# EAGLE schematic msp430_minimal_schematic (EAGLE 7.0.0)
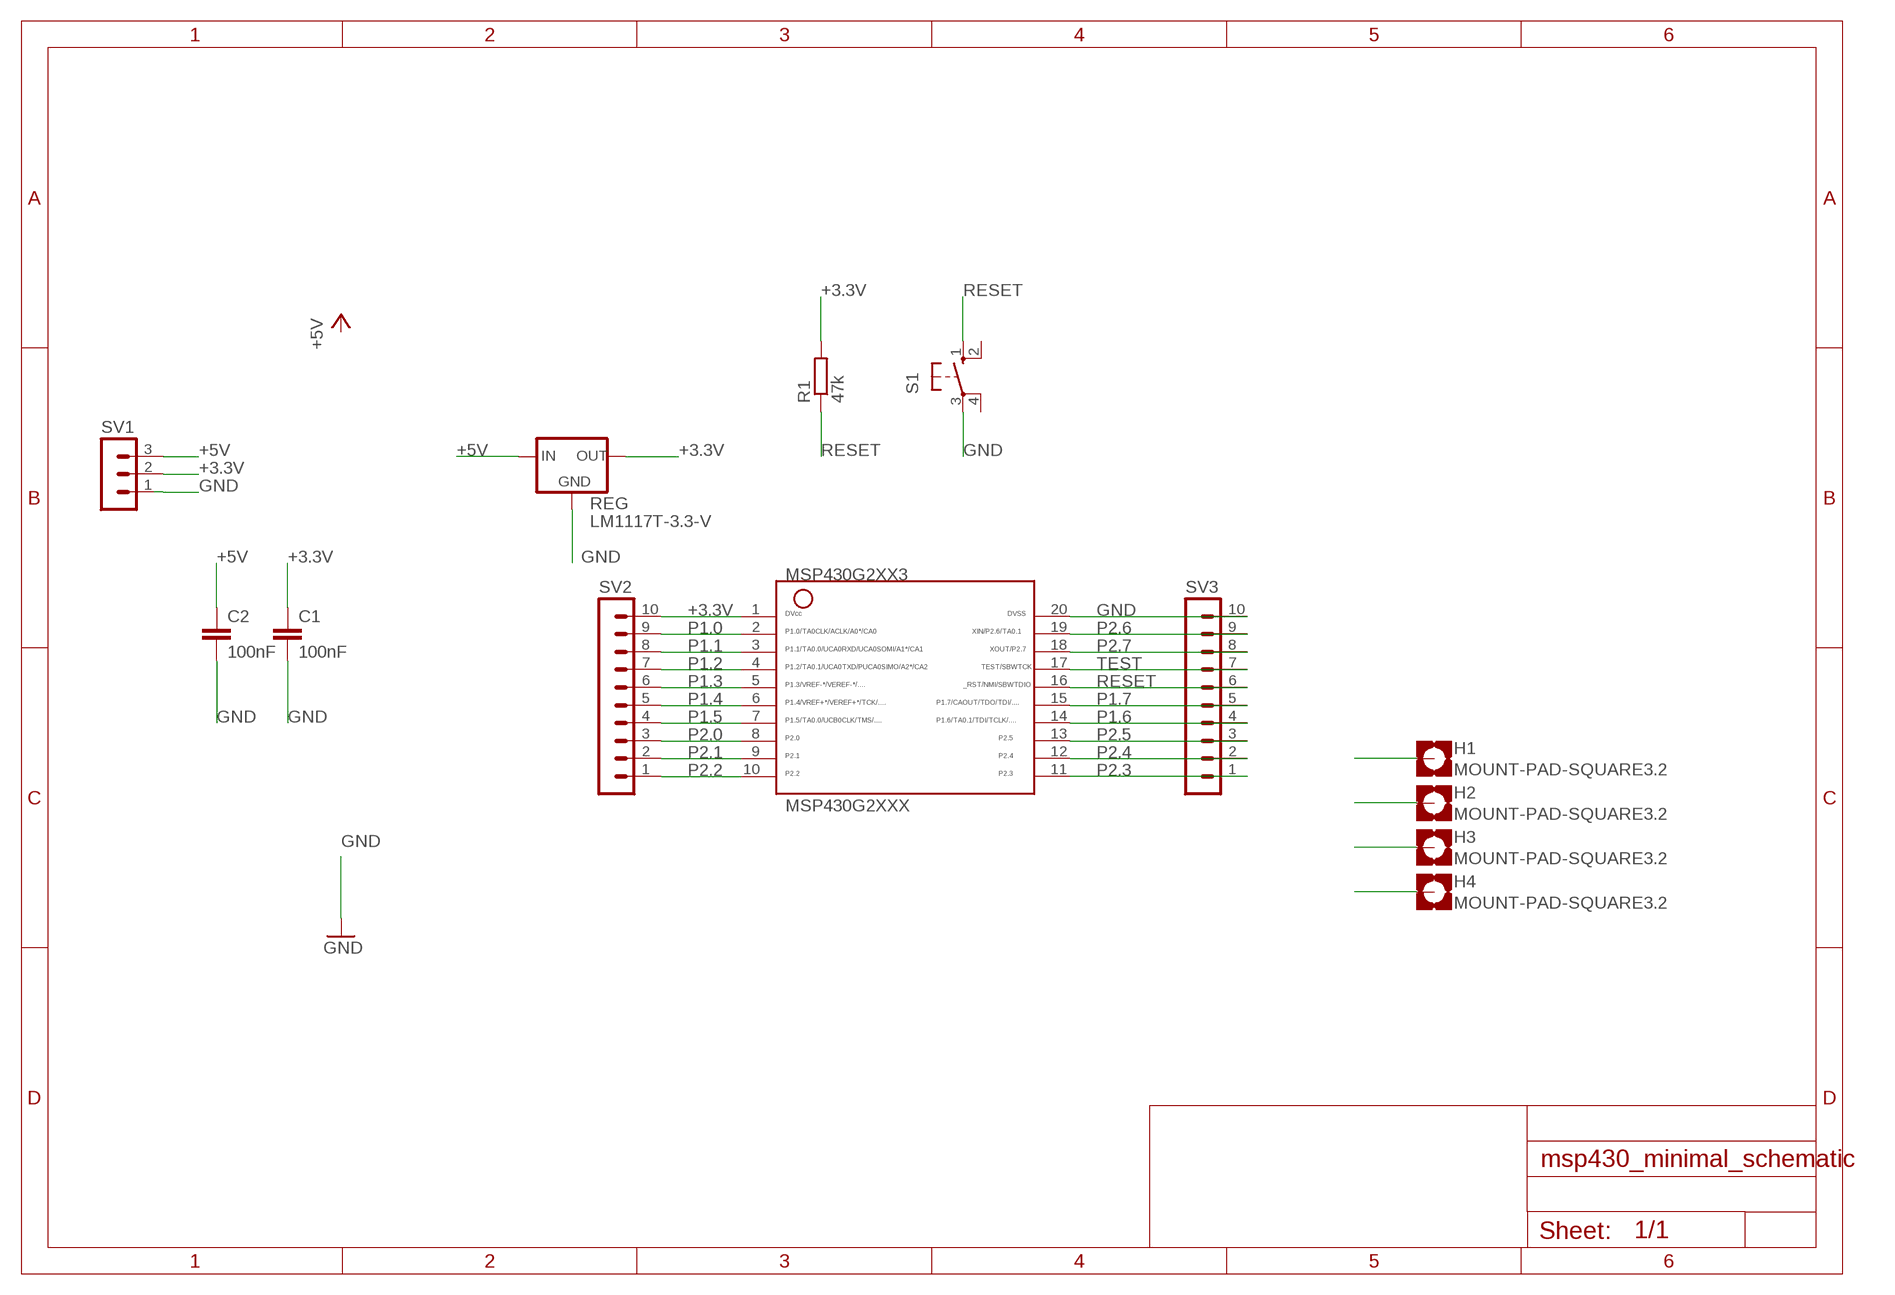
[diagram p0: schematic, sheet 1]

## Parts
C1  100nF  C-EU050-030X075  [C050-030X075]
C2  100nF  C-EU050-030X075  [C050-030X075]
H1  MOUNT-PAD-SQUARE3.2  [3,2-PAD-SQUARE]
H2  MOUNT-PAD-SQUARE3.2  [3,2-PAD-SQUARE]
H3  MOUNT-PAD-SQUARE3.2  [3,2-PAD-SQUARE]
H4  MOUNT-PAD-SQUARE3.2  [3,2-PAD-SQUARE]
MSP430G2XXX  G2XX3---N20  [N20]
R1  47k  R-EU_0204/7  [0204/7]
REG  LM1117T-3.3-V  [TO220V]
S1  10-XX  [B3F-10XX]
SV1  MA03-1  [MA03-1]
SV2  MA10-1  [MA10-1]
SV3  MA10-1  [MA10-1]

## Nets
+3.3V: C1.1 MSP430G2XXX.1 R1.2 REG.2(OUT) SV1.2 SV2.10
+5V: C2.1 REG.3(IN) SV1.3
GND: C1.2 C2.2 H1.B3,2(MOUNT) H2.B3,2(MOUNT) H3.B3,2(MOUNT) H4.B3,2(MOUNT) MSP430G2XXX.20 REG.1(GND) S1.3(P) SV1.1 SV3.10
P1.0: MSP430G2XXX.2 SV2.9
P1.1: MSP430G2XXX.3 SV2.8
P1.2: MSP430G2XXX.4 SV2.7
P1.3: MSP430G2XXX.5 SV2.6
P1.4: MSP430G2XXX.6 SV2.5
P1.5: MSP430G2XXX.7 SV2.4
P1.6: MSP430G2XXX.14 SV3.4
P1.7: MSP430G2XXX.15 SV3.5
P2.0: MSP430G2XXX.8 SV2.3
P2.1: MSP430G2XXX.9 SV2.2
P2.2: MSP430G2XXX.10 SV2.1
P2.3: MSP430G2XXX.11 SV3.1
P2.4: MSP430G2XXX.12 SV3.2
P2.5: MSP430G2XXX.13 SV3.3
P2.6: MSP430G2XXX.19 SV3.9
P2.7: MSP430G2XXX.18 SV3.8
RESET: MSP430G2XXX.16 R1.1 S1.1(S) SV3.6
TEST: MSP430G2XXX.17 SV3.7
Unconnected: S1.2(S1) S1.4(P1)

## Library data of the parts
C1 C2 = rcl:C-EU: CAPACITOR, European symbol
H1-H4 = holes:MOUNT-PAD-SQUARE: MOUNTING PAD, square
MSP430G2XXX = TI_MSP430_v16:G2XX3---N20: MSP430G2XX1 PDIP (N) 20 Pin Package
R1 = rcl:R-EU_: RESISTOR, European symbol
REG = lm1117:LM1117T-*
S1 = switch-omron:10-XX: OMRON SWITCH; MPN: B3F-1000; OC_FARNELL: 176432; OC_NEWARK: 36M3542
SV1 = con-lstb:MA03-1: PIN HEADER; OC_FARNELL: unknown; OC_NEWARK: unknown
SV2 SV3 = con-lstb:MA10-1: PIN HEADER; OC_FARNELL: unknown; OC_NEWARK: unknown